# EAGLE schematic Test (EAGLE 9.6.2)
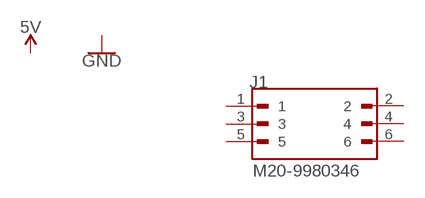
[diagram p0: schematic, sheet 1]

## Parts
J1  M20-9980346  [HARWIN_M20-9980346]
Unconnected: J1.1 J1.2 J1.3 J1.4 J1.5 J1.6

## Library data of the parts
J1 = M20-9980346:M20-9980346; MANUFACTURER: HARWIN; STANDARD: Manufacturer Recommendations